# Altium schematic sheet EMG_Sensors_Power.SchDoc
size 431 x 279 mm; SheetNumber: 1; SheetTotal: 1; ENG_APP_DATE: --/--/--; DSN_APP_DATE: --/--/--; CHK_APP_DATE: --/--/--
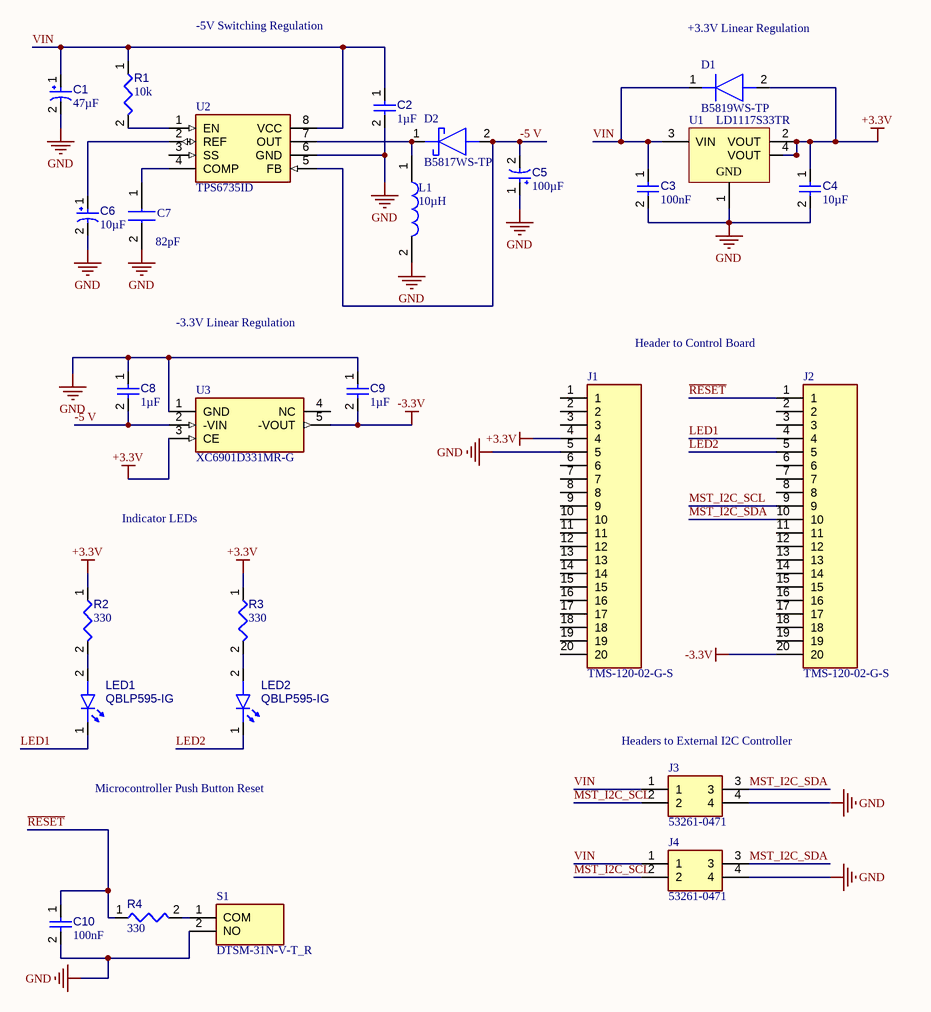
[diagram p0: EMG_Sensors_Power.SchDoc]

## Parts
C1  value 47µF  [AVX-TAJ-C-2_L]  (hidden comment: TAJC476K016RNJ)
C2  value 1µF  [CAPC1608X94X35NL15T15]  (hidden comment: Capacitor 1 uF +/- 10% 16 V 0603)
C3  value 100nF  [CAPC1005X56X25LL10T15]  (hidden comment: Capacitor 0.1 uF +/- 5% 16 V 0402)
C4  value 10µF  [CAPC2013X135X45NL10T25]  (hidden comment: Capacitor 10 uF +/- 10% 16 V 0805)
C5  value 100µF  [AVX-TAJ-C-2_L]  (hidden comment: TAJC107K010RNJ)
C6  value 10µF  [CAPMP3217X18-T_V]  (hidden comment: TAJA106K016RNJ)
C7  82pF  [CAPC0603X33N]
C8  value 1µF  [CAPC1608X90X35ML15T15]  (hidden comment: Capacitor 1uF +/- 10% 16V 0603)
C9  value 1µF  [CAPC1608X90X35ML15T15]  (hidden comment: Capacitor 1uF +/- 10% 16V 0603)
C10  value 100nF  [CAPC1005X56X25LL10T15]  (hidden comment: Capacitor 0.1 uF +/- 5% 16 V 0402)
D1  B5819WS-TP  [SOD2512X115N]
D2  B5817WS-TP  [SOD2512X115N]
J1  TMS-120-02-G-S  [TMS-120-YY-XX-S]
J2  TMS-120-02-G-S  [TMS-120-YY-XX-S]
J3  53261-0471  [53261-0471]
J4  53261-0471  [53261-0471]
L1  10µH  [DO1608C]
LED1  QBLP595-IG  [QTB-QBLP595_V]
LED2  QBLP595-IG  [QTB-QBLP595_V]
R1  value 10k  [RESC1005X40X25ML05T05]  (hidden comment: Resistor 10k +/-1% 0402 63 mW)
R2  value 330  [RESC0402(1005)_L]  (hidden comment: Resistor 330R +/-5 % 0402 63 mW)
R3  value 330  [RESC0402(1005)_L]  (hidden comment: Resistor 330R +/-5 % 0402 63 mW)
R4  value 330  [RESC0402(1005)_L]  (hidden comment: Resistor 330R +/-5 % 0402 63 mW)
S1  DTSM-31N-V-T_R  [DTSM32NVTR]
U1  LD1117S33TR  [SOT-223_L]
U2  TPS6735ID  [SOIC127P600X175-8N]
U3  XC6901D331MR-G  [SOT95P280X130-5N]

## Nets
+3.3V: C4.1 D1.2(A) J1.4 R2.1 R3.1 U1.2(VOUT) U1.4(VOUT) U3.3(CE)
-3.3V: C9.2 J2.20 U3.5(-VOUT)
GND: C1.2 C2.2 C3.2 C4.2 C5.1 C6.2 C7.2 C8.1 C9.1 C10.2 J1.5 J3.4 J4.4 L1.2 S1.2(NO) U1.1(GND) U2.6(GND) U3.1(GND)
-5 V: C5.2 C8.2 D2.2(A) U2.5(FB) U3.2(-VIN)
~{RESET}: C10.1 J2.1 R4.1
LED1: J2.4 LED1.1(K)
LED2: J2.5 LED2.1(K)
MST_I2C_SCL: J2.9 J3.2 J4.2
MST_I2C_SDA: J2.10 J3.3 J4.3
VIN: C1.1 C2.1 C3.1 D1.1(K) J3.1 J4.1 R1.1 U1.3(VIN) U2.8(VCC)
NetC6_1: C6.1 U2.2(REF)
NetC7_1: C7.1 U2.4(COMP)
NetD2_1: D2.1(K) L1.1 U2.7(OUT)
NetLED1_2: LED1.2(A) R2.2
NetLED2_2: LED2.2(A) R3.2
NetR1_2: R1.2 U2.1(EN)
NetR4_2: R4.2 S1.1(COM)

Not connected (* = marked no-connect by the designer): J1 1 2 3 6 7 8 9 10 11 12 13 14 15 16 17 18 19 20; J2 2 3 6 7 8 11 12 13 14 15 16 17 18 19; U2 3(SS); U3 4(NC)

## Notes on the sheet
- -5V Switching Regulation
- (near D1) +3.3V Linear Regulation
- -3.3V Linear Regulation
- Header to Control Board
- Indicator LEDs
- Microcontroller Push Button Reset
- (near J3) Headers to External I2C Controller
- DWG. NO.
- REV.
- SHT.
- THIS DOCUMENT AND THE DATA DISCLOSED HEREIN OR HEREWITH IS THE PROPERTY OF ALTIUM LIMITED AND MAY BE FREELY DISTRIBUTED IN WHOLE. NO RIGHTS ARE RESERVED OR EXPRESS OR IMPLIED WARANTEE GIVEN.
- REVISION
- DESCRIPTION
- DATE
- APPROVED
- ENG:
- APPROVALS
- PROJECT
- DSN:
- CHK:
- REFERENCE DOCUMENTS
- PROJECT REVISION:
- TITLE
- DOCUMENT REVISION:
- DESIGN ITEM:
- BOM:
- FAB DWG:
- PCB DWG:
- ASSY DWG:
- SCALE:
- SIZE
- B
- CAGE CODE
- FILE NAME
- DWG NO.
- SHEET
- OF
- REV

## Library data of the parts
C1 = CMP-001-00047-7: Standard Tantalum, 47 uF, +/- 10%, 16 V, -55 to 125 degC, 2312 (6032 Metric), RoHS, Tape and Reel TAJC476K016RNJ; Manufacturer: AVX; Voltage Rating: 16V; Resistance: 0.5Ohm; ESR: 500mohm; RoHS Compliant: True; Max Operating Temperature: 125°C; Manufacturer URL: http://www.avx.com/; Tolerance: 10%; Package Quantity: 500; Case/Package: 2312; Package Description: 2-Pin Surface Mount Device, Body 6 x 3.25 mm; Datasheet Version: Feb-16; Package Reference: TAJ-C-2; Datasheet URL: http://datasheets.avx.com/TAJ.pdf; Pins: 2; Packaging: TapeandReel; Min Operating Temperature: -55°C; Capacitor Type: Tantalum; Mounting Technology: SM
C2 = CMP-001-00003-6: Chip Capacitor, 1 uF, +/- 10%, 16 V, 0603 (1608 Metric); Voltage Rating: 16V; Capacitor Type: Ceramic; Max Operating Temperature: 125°C; Pins: 2; Tolerance: 10%; Min Operating Temperature: -55°C; RoHS Compliant: True; Mounting Technology: SM; Case/Package: 0603
C3 C10 = CMP-001-00001-6: Chip Capacitor, 0.1 uF, +/- 5%, 16 V, 0402 (1005 Metric); Capacitor Type: Ceramic; Voltage Rating: 16V; Max Operating Temperature: 125°C; Min Operating Temperature: -55°C; Case/Package: 0402; Mounting Technology: SM; Pins: 2; Tolerance: 5%; RoHS Compliant: True
C4 = CMP-001-00015-6: Chip Capacitor, 10 uF, +/- 10%, 16 V, 0805 (2012 Metric); Voltage Rating: 16V; Capacitor Type: Ceramic; RoHS Compliant: True; Max Operating Temperature: 85°C; Min Operating Temperature: -55°C; Mounting Technology: SM; Tolerance: 10%; Case/Package: 0805; Pins: 2
C5 = CMP-001-00045-7: Standard Tantalum, 100 uF, +/- 10%, 10 V, -55 to 125 degC, 2312 (6032 Metric), RoHS, Tape and Reel TAJC107K010RNJ; Manufacturer: AVX; Voltage Rating: 10V; ESR: 1.2Ohm; Datasheet URL: http://datasheets.avx.com/TAJ.pdf; Pins: 2; Tolerance: 10%; Packaging: TapeandReel; Capacitor Type: Tantalum; Datasheet Version: Feb-16; Package Quantity: 500; Min Operating Temperature: -55°C; Mounting Technology: SM; Case/Package: 2412; Manufacturer URL: http://www.avx.com/; RoHS Compliant: True; Package Description: 2-Pin Surface Mount Device, Body 6 x 3.25 mm; Max Operating Temperature: 125°C; Package Reference: TAJ-C-2
C6 = CMP-001-00041-7: Standard Tantalum, 10 uF, +/- 10%, 16 V, -55 to 125 degC, 1206 (3216 Metric), RoHS, Tape and Reel TAJA106K016RNJ; Manufacturer: AVX; Voltage Rating: 16V; ESR: 3Ohm; Datasheet URL: http://datasheets.avx.com/TAJ.pdf; Package URL: http://www.avx.com/download/software/literature/AVX-Footprint-Library.pdf; Pins: 2; Package Reference: CAPMP3217X18-T; RoHS Compliant: True; Case/Package: 1206; Max Operating Temperature: 125°C; Package Description: 2-Pin Surface Mount Device, Body 3.2 x 1.65 mm; Mounting Technology: SM; Tolerance: 10%; Package Quantity: 1; Packaging: TapeandReel; Min Operating Temperature: -55°C; Datasheet Version: Feb-16; Manufacturer URL: http://www.avx.com/; Capacitor Type: Tantalum
C7 = GRM0335C1H820JA01D: Capacitor 82pF  GRM0335C1H820JA01D; Manufacturer_Name: Murata Electronics; Datasheet Link: https://psearch.en.murata.com/capacitor/product/GRM0335C1H820JA01%23.html; Height: 0.33mm; Manufacturer_Part_Number: GRM0335C1H820JA01D
C8 C9 = CMP-001-00004-6: Chip Capacitor, 1 uF, +/- 10%, 16 V, 0603 (1608 Metric); Capacitor Type: Ceramic; Mounting Technology: SM; RoHS Compliant: True; Min Operating Temperature: -55°C; Case/Package: 0603; Pins: 2; Voltage Rating: 16V; Max Operating Temperature: 125°C; Tolerance: 10%
D1 = B5819WS-TP: Diode B5819WS-TP; Manufacturer_Name: Micro Commercial Components (MCC); Datasheet Link: https://www.arrow.com/en/products/b5819ws-tp/micro-commercial-components; Height: 1.15mm; Manufacturer_Part_Number: B5819WS-TP; Mouser Part Number: 833-B5819WS-TP; Mouser Price/Stock: https://www.mouser.co.uk/ProductDetail/Micro-Commercial-Components-MCC/B5819WS-TP?qs=SdqRYZZ9IxBOLbXcW6zYBA%3D%3D; Arrow Part Number: B5819WS-TP; Arrow Price/Stock: https://www.arrow.com/en/products/b5819ws-tp/micro-commercial-components?region=nac
D2 = B5817WS-TP: Schottky Diode B5817WS-TP; Manufacturer_Name: Micro Commercial Components (MCC); Datasheet Link: https://www.mouser.co.uk/datasheet/2/258/B5817WS-B5819WS(SOD-323)-V2-1626103.pdf; Height: 1.15mm; Manufacturer_Part_Number: B5817WS-TP; Mouser Part Number: 833-B5817WS-TP; Mouser Price/Stock: https://www.mouser.co.uk/ProductDetail/Micro-Commercial-Components-MCC/B5817WS-TP?qs=SdqRYZZ9IxCAZAlW9BKhPg%3D%3D; Arrow Part Number: B5817WS-TP; Arrow Price/Stock: https://www.arrow.com/en/products/b5817ws-tp/micro-commercial-components?region=europe
J1 J2 = TMS-120-02-G-S: Connector - female needed, place under board TMS-120-02-G-S; Manufacturer_Name: SAMTEC; Datasheet Link: http://suddendocs.samtec.com/prints/tms-1xx-xx-xx-x-xx-xxx-mkt.pdf; Manufacturer_Part_Number: TMS-120-02-G-S; Mouser Part Number: 200-TMS12002GS; Mouser Price/Stock: https://www.mouser.co.uk/ProductDetail/Samtec/TMS-120-02-G-S?qs=0lQeLiL1qyZLykZTiH0Mag%3D%3D
J3 J4 = 53261-0471: Connector 53261-0471; Manufacturer_Name: Molex; Datasheet Link: http://www.molex.com/webdocs/datasheets/pdf/en-us//0532610471_PCB_HEADERS.pdf; Manufacturer_Part_Number: 53261-0471; Mouser Part Number: 538-53261-0471; Mouser Price/Stock: https://www.mouser.co.uk/ProductDetail/Molex/53261-0471?qs=%252B72YyncTwW9e3et3PwnEMw%3D%3D
L1 = DO1608C-103MLC: Inductor 10µH DO1608C-103MLC; Manufacturer_Name: COILCRAFT; Datasheet Link: https://www.coilcraft.com/pdfs/do1608c.pdf; Manufacturer_Part_Number: DO1608C-103MLC; Mouser Part Number: 994-DO1608C-103MLC; Mouser Price/Stock: https://www.mouser.co.uk/ProductDetail/Coilcraft/DO1608C-103MLC?qs=zCSbvcPd3pYY5dYqZHdNQA%3D%3D
LED1 LED2 = CMP-007-00041-3: Chip LED 0402, Green, 0.02 A, 3.1 to 3.7 V, -40 to 80 degC, 2-Pin SMD, RoHS, Tape and Reel QBLP595-IG; Case/Package: 0402; Colour: Green; Mounting Technology: SMT; Pins: 2; RoHS Compliant: Yes
R1 = CMP-009-00019-5: Chip Resistor, 10 KOhm, +/- 1%, 63 mW, -55 to 155 degC, 0402 (1005 Metric); Power: 63mW; Voltage Rating: 50V; Case/Package: 0402; Mounting Technology: SM; Pins: 2; Min Operating Temperature: -55°C; Tolerance: 1%; RoHS Compliant: True; Max Operating Temperature: 155°C
R2-R4 = CMP-009-00132-3: Chip Resistor, 330 Ohms, +/-5 %, 63 mW, -55 to 155 degC, 0402; Power: 63mW; Tolerance: 5%; Pins: 2; Max Operating Temperature: 155°C; Min Operating Temperature: -55°C; Case/Package: 0402
S1 = DTSM-31N-V-T_R: Switch DTSM-31N-V-T_R; Manufacturer_Name: Diptronics; Manufacturer_Part_Number: DTSM-31N-V-T/R; Datasheet Link: http://www.dip.com.tw/en/en-product-information/en-switch004/item/2444-dts-3-dtsm-l-3; Height: 5mm; Mouser Part Number: 113-DTSM31NVTR; Mouser Price/Stock: https://www.mouser.co.uk/ProductDetail/Diptronics/DTSM-31N-V-T-R?qs=MLItCLRbWszzBdU5lCl7JA%3D%3D
U1 = CMP-0244-00310-1: Fixed Low Drop Positive Voltage Regulator, 3.3V, 4-Pin SOT-223, Tape and Reel; ComponentLink2Description: Datasheet; PackageDescription: 4-Pin SOT-223 Package, 6.5 x 3.5 mm Body, 2.3 mm Pitch, 7 mm Lead Span; PackageVersion: 2010; ComponentLink2URL: http://www.st.com/internet/com/TECHNICAL_RESOURCES/TECHNICAL_LITERATURE/DATASHEET/CD00000544.pdf; PackageReference: SOT-223; DatasheetVersion: 1/11/2011; ComponentLink1Description: Manufacturer URL; ComponentLink1URL: http://www.st.com
U2 = TPS6735ID: Power Supply; Manufacturer_Name: Texas Instruments; Datasheet Link: https://www.ti.com.cn/cn/lit/ds/symlink/tps6735.pdf?ts=1616851433916&ref_url=https%253A%252F%252Fwww.ti.com.cn%252Fsitesearch%252Fcn%252Fdocs%252Funiversalsearch.tsp%253FsearchTerm%253Dtps6735; Height: 1.75mm; Manufacturer_Part_Number: TPS6735ID; Mouser Part Number: 595-TPS6735ID; Mouser Price/Stock: https://www.mouser.co.uk/ProductDetail/Texas-Instruments/TPS6735ID?qs=YhsVCygOPE2B2F%252BGef%2FDjA%3D%3D
U3 = XC6901D331MR-G: Power Supply XC6901D331MR-G; Manufacturer_Name: Torex; Datasheet Link: https://ms.componentsearchengine.com/Datasheets/2/XC6901D331MR-G.pdf; Height: 1.3mm; Manufacturer_Part_Number: XC6901D331MR-G; Mouser Part Number: 865-XC6901D331MR-G; Mouser Price/Stock: https://www.mouser.co.uk/ProductDetail/Torex-Semiconductor/XC6901D331MR-G?qs=AsjdqWjXhJ%2FQIk2kdQmgqw%3D%3D